# EAGLE design L298213 (EAGLE 7.6.0)
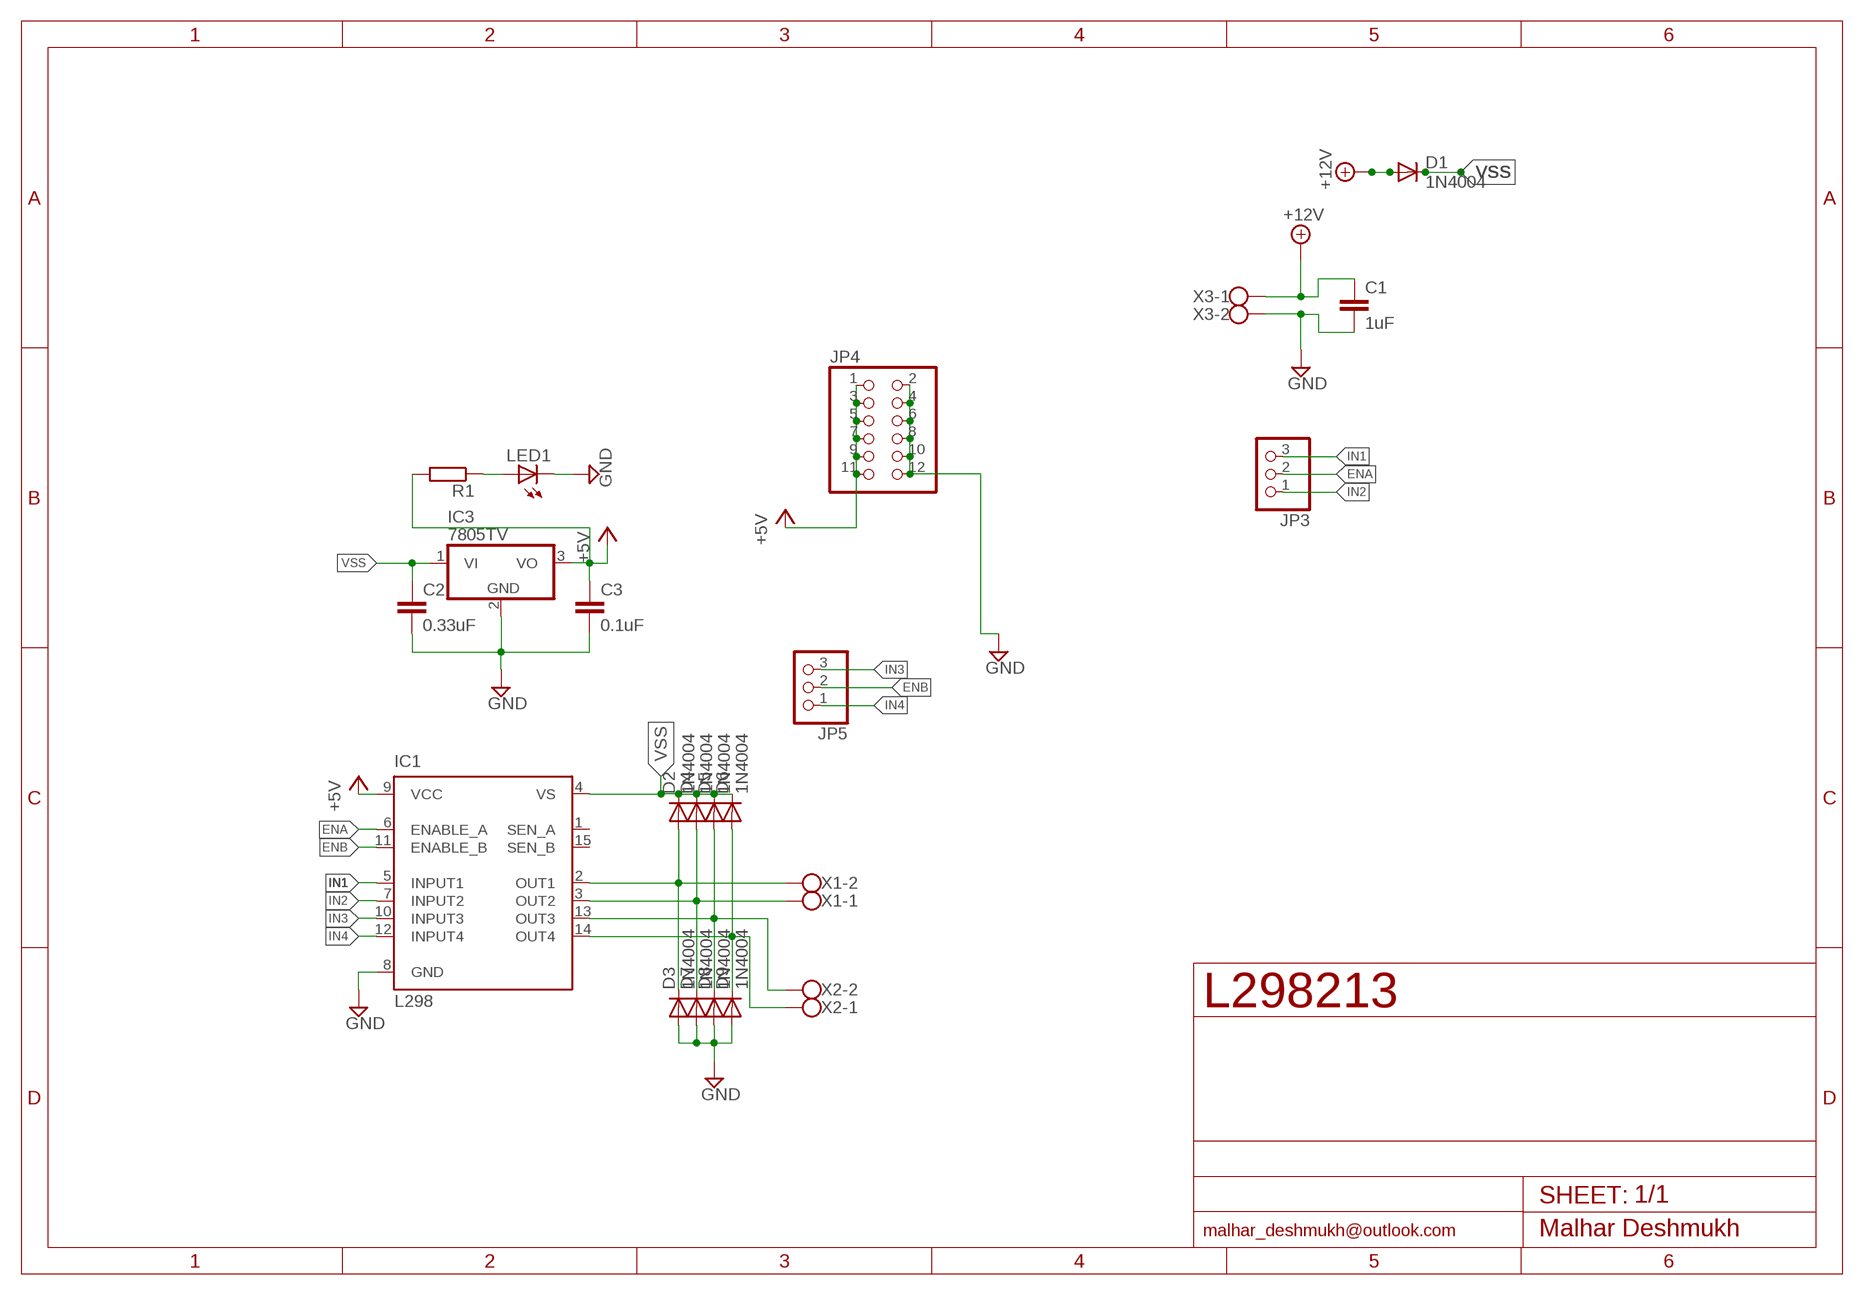
[diagram p0: schematic, sheet 1]

## Parts
C1  1uF  C-EU050-024X044  [C050-024X044]
C2  0.33uF  C-EU050-024X044  [C050-024X044]
C3  0.1uF  C-EU050-024X044  [C050-024X044]
D1  1N4004  [DO41-10]
D2  1N4004  [DO41-10]
D3  1N4004  [DO41-10]
D4  1N4004  [DO41-10]
D5  1N4004  [DO41-10]
D6  1N4004  [DO41-10]
D7  1N4004  [DO41-10]
D8  1N4004  [DO41-10]
D9  1N4004  [DO41-10]
IC1  L298  [MULTIWATT-15]
IC3  7805TV  [TO220V]
JP3  PINHD-1X3  [1X03]
JP4  PINHD-2X6  [2X06]
JP5  PINHD-1X3  [1X03]
LED1  LED3MM  [LED3MM]
R1  R-EU_0207/5V  [0207/5V]
X1  W237-102  [W237-102]
X2  W237-102  [W237-102]
X3  W237-102  [W237-102]

## Nets
+5V: C3.1 IC1.9(VCC) IC3.3(VO) JP4.1 JP4.3 JP4.5 JP4.7 JP4.9 JP4.11 R1.2
+12V: C1.1 D1.A X3.1
ENA: IC1.6(ENABLE_A) JP3.2
ENB: IC1.11(ENABLE_B) JP5.2
GND: C1.2 C2.2 C3.2 D3.A D7.A D8.A D9.A IC1.8(GND) IC3.2(GND) JP4.2 JP4.4 JP4.6 JP4.8 JP4.10 JP4.12 LED1.K(C) X3.2
IN1: IC1.5(INPUT1) JP3.3
IN2: IC1.7(INPUT2) JP3.1
IN3: IC1.10(INPUT3) JP5.3
IN4: IC1.12(INPUT4) JP5.1
N$1: D2.A D3.C IC1.2(OUT1) X1.2
N$2: D4.A D7.C IC1.3(OUT2) X1.1
N$3: D5.A D8.C IC1.13(OUT3) X2.2
N$4: D6.A D9.C IC1.14(OUT4) X2.1
N$5: LED1.A R1.1
VSS: C2.1 D1.C D2.C D4.C D5.C D6.C IC1.4(VS) IC3.1(VI)
Unconnected: IC1.1(SEN_A) IC1.15(SEN_B)

## Library data of the parts
C1-C3 = resistor:C-EU: CAPACITOR, European symbol
D1-D9 = adafruit:1N4004: DIODE General purpose 1N400x type rectifier (With bigger pads) http://www.ladyada.net/library/pcb/eaglelibrary.html
IC1 = st-microelectronics:L298: DUAL FULL-BRIDGE DRIVER; MPN: L298N; OC_FARNELL: 1589425; OC_NEWARK: 32M1527
IC3 = linear:78*: Positive VOLTAGE REGULATOR Source: http://cache.national.com/ds/LM/LM78L05.pdf http://www.fairchildsemi.com/ds/LM/LM7805.pdf
JP3 JP5 = pinhead:PINHD-1X3: PIN HEADER
JP4 = pinhead:PINHD-2X6: PIN HEADER
LED1 = led:LED: LED OSRAM: - CHIPLED LG R971, LG N971, LY N971, LG Q971, LY Q971, LO R971, LY R971 LH N974, LH R974 LS Q976, LO Q976, LY Q976 LO Q996 - Hyper CHIPLED LW Q18S LB Q993, LB Q99A, LB R99A - SideLED LS A670, LO A670, LY A670, LG A670, LP A670 LB A673, LV A673, LT A673, LW A673 LH A674 LY A675 LS A676, LA A676, LO A676, LY A676, LW A676 LS A679, LY A679, LG A679 - Hyper Micro SIDELED® LS Y876, LA Y876, LO Y876, LY Y876 LT Y87S - SmartLED LW L88C, LW L88S LB L89C, LB L89S, LG L890 LS L89K, LO L89K, LY L89K LS L896, LA L896, LO L896, LY L896 - TOPLED LS T670, LO T670, LY T670, LG T670, LP T670 LSG T670, LSP T670, LSY T670, LOP T670, LYG T670 LG T671, LOG T671, LSG T671 LB T673, LV T673, LT T673, LW T673 LH T674 LS T676, LA T676, LO T676, LY T676, LB T676, LH T676, LSB T676, LW T676 LB T67C, LV T67C, LT T67C, LS T67K, LO T67K, LY T67K, LW E67C LS E67B, LA E67B, LO E67B, LY E67B, LB E67C, LV E67C, LT E67C LW T67C LS T679, LY T679, LG T679 LS T770, LO T770, LY T770, LG T770, LP T770 LB T773, LV T773, LT T773, LW T773 LH T774 LS E675, LA E675, LY E675, LS T675 LS T776, LA T776, LO T776, LY T776, LB T776 LHGB T686 LT T68C, LB T68C - Hyper Mini TOPLED® LB M676 - Mini TOPLED Santana® LG M470 LS M47K, LO M47K, LY M47K Source: http://www.osram.convergy.de LUXEON: - LUMILED® LXK2-PW12-R00, LXK2-PW12-S00, LXK2-PW14-U00, LXK2-PW14-V00 LXK2-PM12-R00, LXK2-PM12-S00, LXK2-PM14-U00 LXK2-PE12-Q00, LXK2-PE12-R00, LXK2-PE12-S00, LXK2-PE14-T00, LXK2-PE14-U00 LXK2-PB12-K00, LXK2-PB12-L00, LXK2-PB12-M00, LXK2-PB14-N00, LXK2-PB14-P00, LXK2-PB14-Q00 LXK2-PR12-L00, LXK2-PR12-M00, LXK2-PR14-Q00, LXK2-PR14-R00 LXK2-PD12-Q00, LXK2-PD12-R00, LXK2-PD12-S00 LXK2-PH12-R00, LXK2-PH12-S00 LXK2-PL12-P00, LXK2-PL12-Q00, LXK2-PL12-R00 Source: www.luxeon.com KINGBRIGHT: KA-3528ASYC Source: www.kingbright.com
R1 = resistor:R-EU_: RESISTOR, European symbol
X1-X3 = con-wago-500:W237-102: WAGO SCREW CLAMP; MPN: 237-102; OC_FARNELL: unknown; OC_NEWARK: 70K9898

## Board
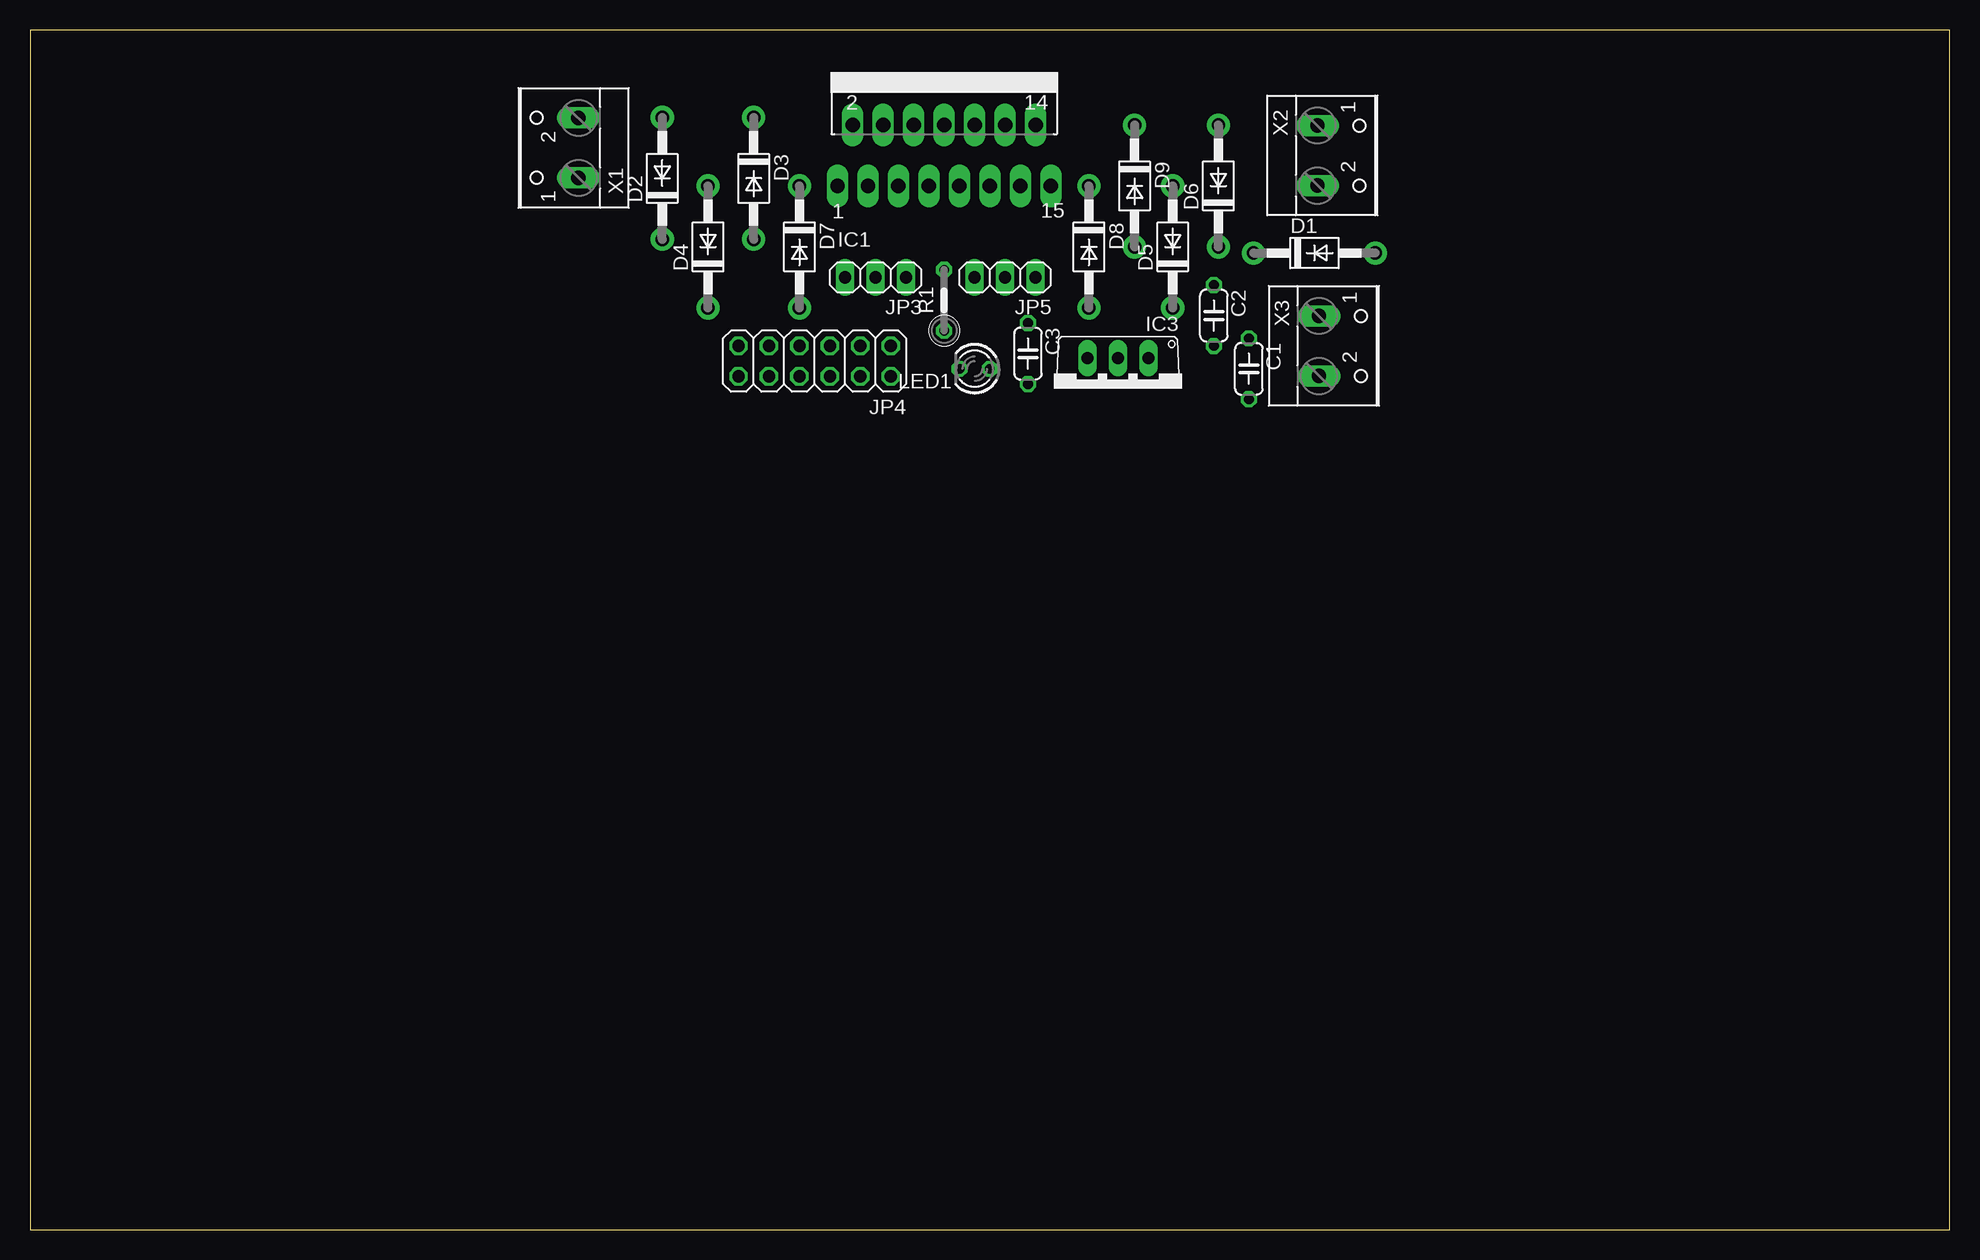
[diagram p1: board, top side]
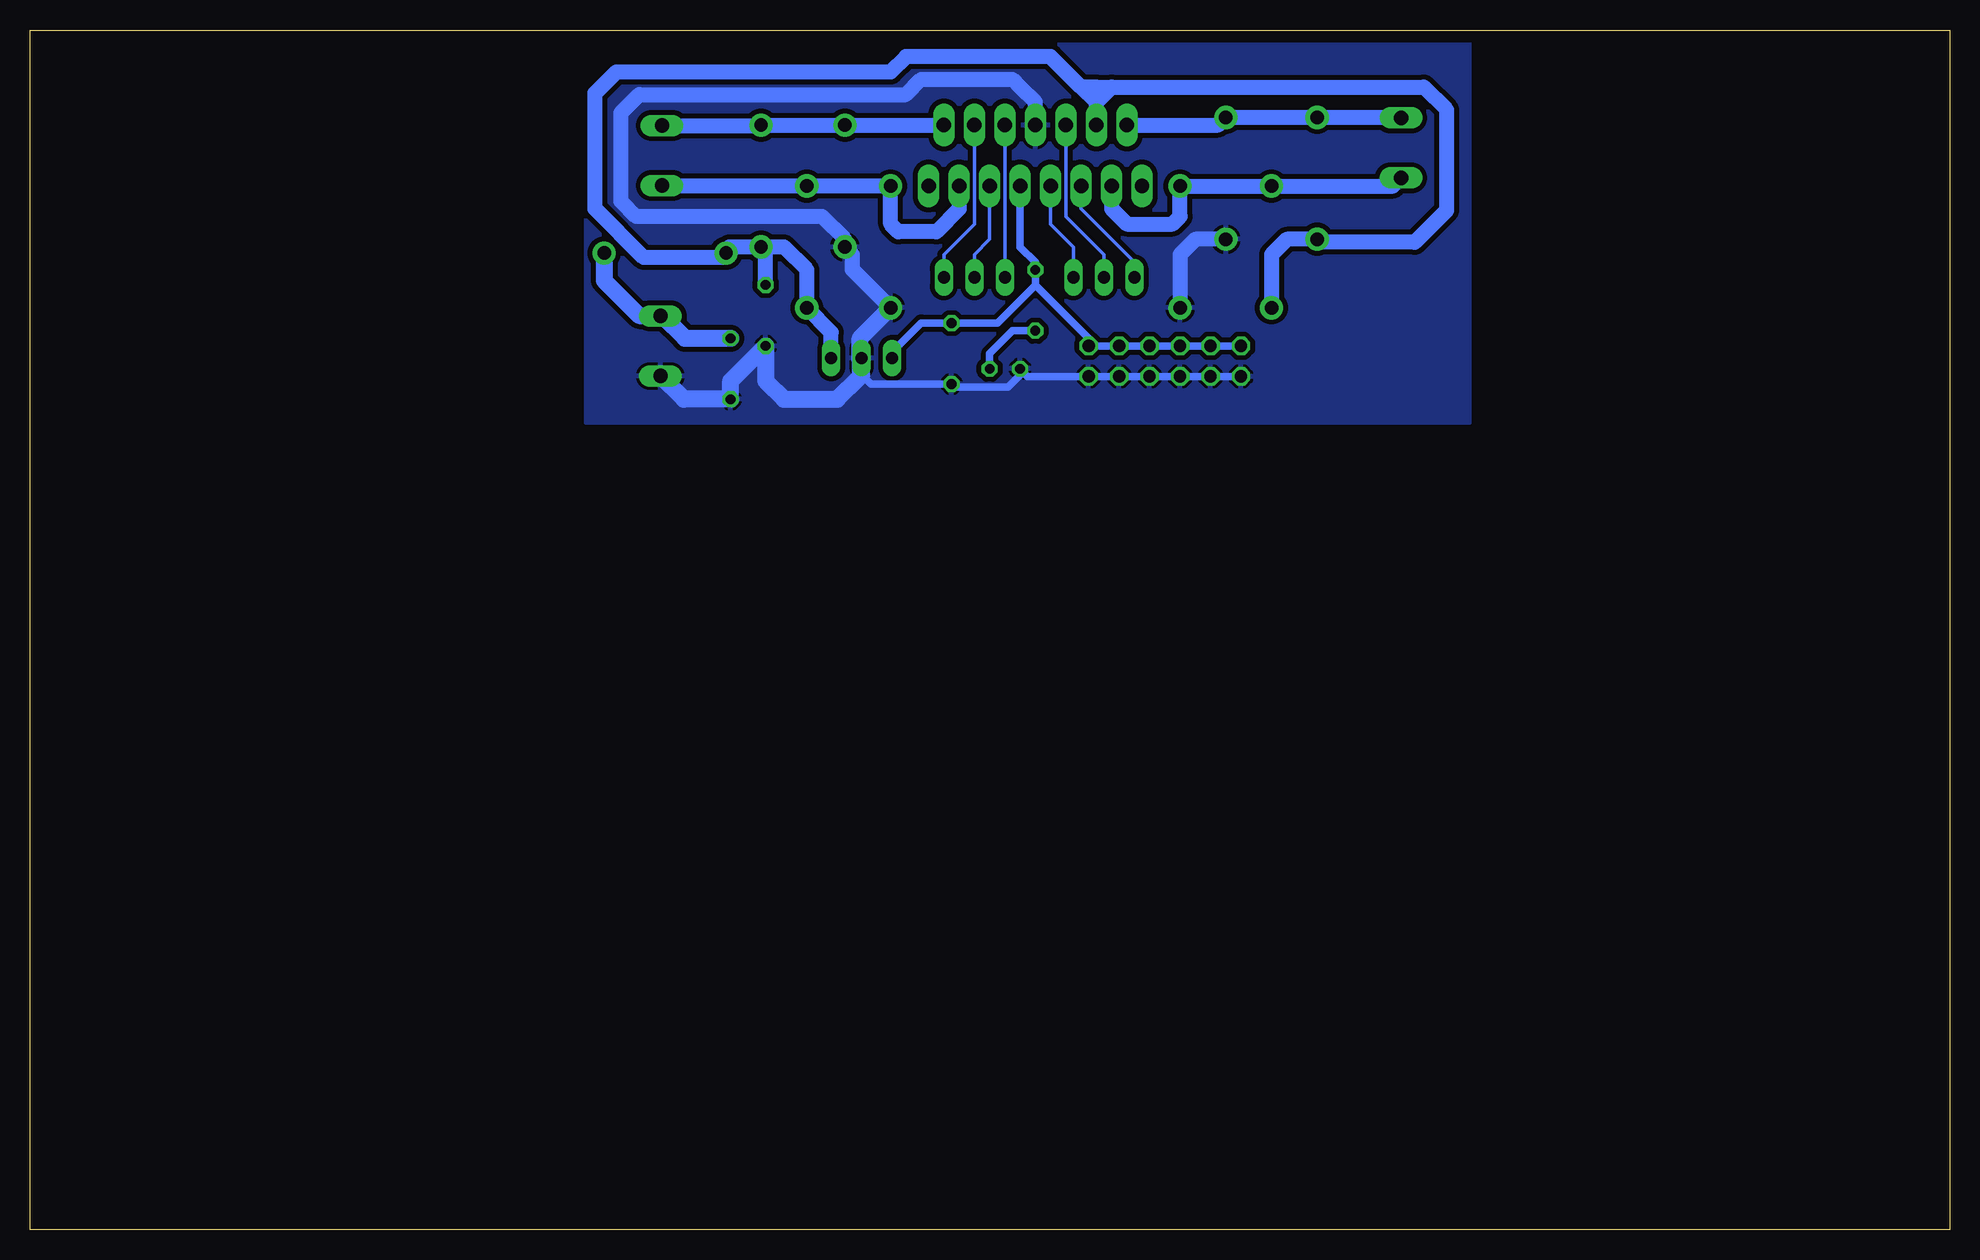
[diagram p2: board, bottom side, seen from below]

Size 160 x 100 mm. Coordinates in mm from the lower left corner, seen from the top.
Outline: 0,0 160,0 160,100 0,100 0,0
Copper layers (1*16): Top 0.035mm / dielectric 1.5mm / Bottom 0.035mm
Design rules "default": minimum track width 10mil, minimum drill 24mil, track to track 8mil, track to pad 8mil, pad to pad 8mil, via to via 8mil, smd to smd 8mil, copper to edge 40mil, drill to drill 8mil, minimum pad ring 10mil, minimum via ring 8mil, stop-mask expansion 4mil, vias tented up to drill 0mil, thermal gap 10mil

### Footprints (pad centres in the part's own frame; a part is rotated, then mirrored left to right if it is on the bottom)
C050-024X044 = drill 0.813 octagon: 1 -2.54,0; 2 2.54,0
DO41-10 = drill 1.118 pad 1.93: A 5.08,0; C -5.08,0
MULTIWATT-15 = drill 1.2 long: 1 -8.89,-7.62; 2 -7.62,-2.54; 3 -6.35,-7.62; 4 -5.08,-2.54; 5 -3.81,-7.62; 6 -2.54,-2.54; 7 -1.27,-7.62; 8 0,-2.54; 9 1.27,-7.62; 10 2.54,-2.54; 11 3.81,-7.62; 12 5.08,-2.54; 13 6.35,-7.62; 14 7.62,-2.54; 15 8.89,-7.62
TO220V = drill 1.016 long: 1 -2.54,-2.54; 2 0,-2.54; 3 2.54,-2.54
1X03 = drill 1.016 long: 1 -2.54,0; 2 0,0; 3 2.54,0
2X06 = drill 1.016 octagon: 1 -6.35,-1.27; 2 -6.35,1.27; 3 -3.81,-1.27; 4 -3.81,1.27; 5 -1.27,-1.27; 6 -1.27,1.27; 7 1.27,-1.27; 8 1.27,1.27; 9 3.81,-1.27; 10 3.81,1.27; 11 6.35,-1.27; 12 6.35,1.27
LED3MM = drill 0.813 octagon: A -1.27,0; K 1.27,0
0207/5V = drill 0.813 octagon: 1 -2.54,0; 2 2.54,0
W237-102 = drill 1.194 long: 1 -2.5,-1.27; 2 2.5,-1.27

### Placement (x,y rotation side)
C1  101.6,71.75 270 top
C2  98.68,76.2 270 top
C3  83.19,73.03 270 top
D1  107.06,81.41 0 top
D2  52.7,87.63 90 top
D3  60.33,87.63 270 top
D4  56.52,81.92 90 top
D5  95.25,81.92 90 top
D6  99.06,87 90 top
D7  64.14,81.92 270 top
D8  88.27,81.92 270 top
D9  92.08,87 270 top
IC1  76.2,94.61 0 top
IC3  90.68,70.1 180 top
JP3  70.48,79.38 180 top
JP4  65.41,72.39 180 top
JP5  81.28,79.38 180 top
LED1  78.74,71.75 180 top
R1  76.2,77.47 90 top
X1  44.45,90.17 90 top
X2  108.58,89.53 270 top
X3  108.71,73.66 270 top

### Tracks (layer width: path | path; a pad name or v marks a point on that pad's centre or on a via)
+5V
  Bottom 0.61: IC3.3 88.14,73.15 85.72,75.56 C3.1 79.38,75.56 76.2,78.74 | IC1.9 77.47,81.92 76.2,80.64 R1.2 76.2,78.74 | 76.2,78.74 71.75,74.3 JP4.1 JP4.3 JP4.5 JP4.7 JP4.9 JP4.11
+12V
  Bottom 1.422: D1.A 112.14,79.12 109.22,76.2 107.48,76.2 X3.1 107.28,76.16 105.41,74.3 C1.1
ENA
  Bottom 0.305: IC1.6 73.66,84.45 70.48,81.28 JP3.2
ENB
  Bottom 0.305: IC1.11 80.01,82.55 81.28,81.28 JP5.2
GND
  Bottom 0.61: IC3.2 90.68,71.25 89.92,70.48 C3.2 82.93,70.23 78.49,70.23 77.47,71.25 LED1.K 76.83,71.12 JP4.2 JP4.4 JP4.6 JP4.10 JP4.12
  Bottom 1.27: D3.A 62.87,82.55 64.14,81.28 D7.A | D8.A 91.44,80.01 91.44,81.28 D9.A 92.08,82.55 93.98,84.45 109.47,84.45 110.74,85.72 110.74,93.09 109.22,94.61 87,94.61 85.72,95.89 78.11,95.89 77.47,95.25 76.2,93.98 IC1.8
  Bottom 1.422: X3.2 105.5,69.22 C1.2 101.6,70.74 C2.2 98.68,70.74 97.16,69.22 92.71,69.22 90.81,71.12 | 90.81,71.12 90.68,71.25 | IC3.2 90.68,72.52 90.81,72.39 | 90.81,72.39 90.81,71.12 | 90.81,72.39 90.81,74.3 D8.A
  pour Bottom (isolate 0.406): 40.01,99.06 113.67,99.06 113.67,67.31 40.01,67.31
IN1
  Bottom 0.305: IC1.5 72.39,85.09 67.94,80.64 JP3.3
IN2
  Bottom 0.305: IC1.7 74.93,83.82 73.03,81.92 JP3.1
IN3
  Bottom 0.305: IC1.10 JP5.3
IN4
  Bottom 0.305: IC1.12 81.28,83.82 83.82,81.28 JP5.1
N$1
  Bottom 1.27: IC1.2 60.96,92.08 D3.C D2.A 45.76,92.71 X1.2
N$2
  Bottom 1.27: IC1.3 69.85,85.09 68.58,83.82 64.77,83.82 64.14,84.45 D7.C D4.A 46.4,87 X1.1
N$3
  Bottom 1.27: IC1.13 82.55,85.09 84.45,83.19 87.63,83.19 88.27,83.82 D8.C D5.A 107.28,87 X2.2
N$4
  Bottom 1.27: X2.1 99.1,92.03 D6.A D9.C IC1.14
N$5
  Bottom 0.61: LED1.A 80.01,73.03 78.11,74.93 R1.1
VSS
  Bottom 1.27: D6.C 97.16,81.92 95.25,80.01 D5.C 93.22,74.8 IC3.1 | D4.C 56.52,81.28 55.24,82.55 D2.C 52.45,82.3 44.58,82.3 41.91,84.96 41.91,93.34 43.81,95.25 69.85,95.25 | D6.C 101.47,81.92 D1.C | C2.1 98.68,81.53 D6.C | D6.C 101.73,81.92 101.73,81.41 102.11,81.03 108.84,81.03 112.9,85.09 112.9,94.74 111.12,96.52 88.27,96.52 87,97.79 74.93,97.79 72.39,95.25 | 71.12,93.98 71.12,95.25 | IC1.4 71.12,93.98 | 71.12,93.98 69.85,95.25 | 71.12,95.25 69.85,95.25 | 71.12,95.25 72.39,95.25 | 71.12,93.98 72.39,95.25